# Altium schematic sheet Visual_Indicators.SchDoc: Visual Indicators
size A4; DocumentNumber: 12; SheetNumber: 12; SheetTotal: 12
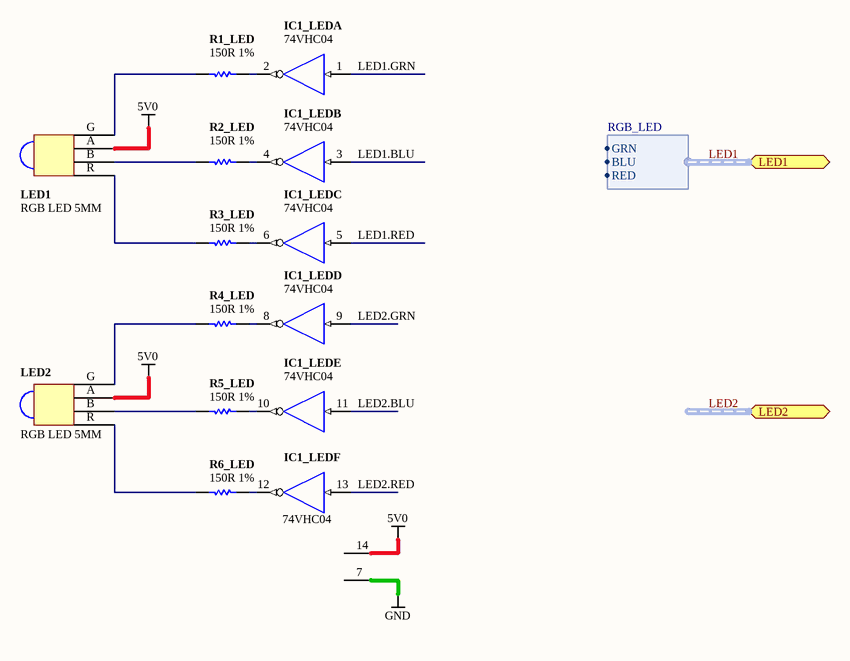
[diagram p0: Visual_Indicators.SchDoc]

## Parts
IC1_LED  74VHC04  [TSSOP14]  (parts A,B,C,D,E,F of 6)
LED1  RGB LED 5MM  [LED-RGB-5MM-RA]
LED2  RGB LED 5MM  [LED-RGB-5MM-RA]
R1_LED  150R 1%  [RESC1005-STAR]
R2_LED  150R 1%  [RESC1005-STAR]
R3_LED  150R 1%  [RESC1005-STAR]
R4_LED  150R 1%  [RESC1005-STAR]
R5_LED  150R 1%  [RESC1005-STAR]
R6_LED  150R 1%  [RESC1005-STAR]

## Ports
LED1 (harness RGB_LED), LED2 (harness RGB_LED)

## Harnesses
RGB_LED: GRN, BLU, RED

## Nets
5V0: IC1_LED.14(VCC) LED1.A LED2.A
GND: IC1_LED.7(GND)
LED1.BLU: IC1_LED.3(A)
LED1.GRN: IC1_LED.1(A)
LED1.RED: IC1_LED.5(A)
LED2.BLU: IC1_LED.11(A)
LED2.GRN: IC1_LED.9(A)
LED2.RED: IC1_LED.13(A)
NetIC1_LED_2: IC1_LED.2(Y) R1_LED.2
NetIC1_LED_4: IC1_LED.4(Y) R2_LED.2
NetIC1_LED_6: IC1_LED.6(Y) R3_LED.2
NetIC1_LED_8: IC1_LED.8(Y) R4_LED.2
NetIC1_LED_10: IC1_LED.10(Y) R5_LED.2
NetIC1_LED_12: IC1_LED.12(Y) R6_LED.2
NetLED1_B: LED1.B R2_LED.1
NetLED1_G: LED1.G R1_LED.1
NetLED1_R: LED1.R R3_LED.1
NetLED2_B: LED2.B R5_LED.1
NetLED2_G: LED2.G R4_LED.1
NetLED2_R: LED2.R R6_LED.1

## Buses and harness runs
harness LED1 = port LED1
harness LED2 = port LED2

## Notes on the sheet
- Sheet Title
- Project Title
- Size:
- Date:
- A4
- Assy:
- Time:
- Revision:
- Sheet
- of
- File:

## Library data of the parts
IC1_LED = D-205-0004: HEX Inverter; Mounting Technology: Surface Mount; Status: Unreleased; Category: IC-Logic
LED1 LED2 = D-153-0001: LED, RGB, 5mm, 540R2GBC-CA, Common Anode; Brightness: 1500 mcd; Peak Wave Length: nm; Color: RGB; Mounting Technology: Through-Hole; Status: Production; Category: LED
R1_LED R2_LED R3_LED R4_LED R5_LED R6_LED = D-100-0005: Resistor, 150R 1% 0402 (1005); Power Rating: 63 mW; Category: Resistor; Mounting Technology: Surface Mount; Resistance: 150 R; Status: Unreleased; Tolerance: 1 %